# Altium project cirq_lcd.PrjPcb
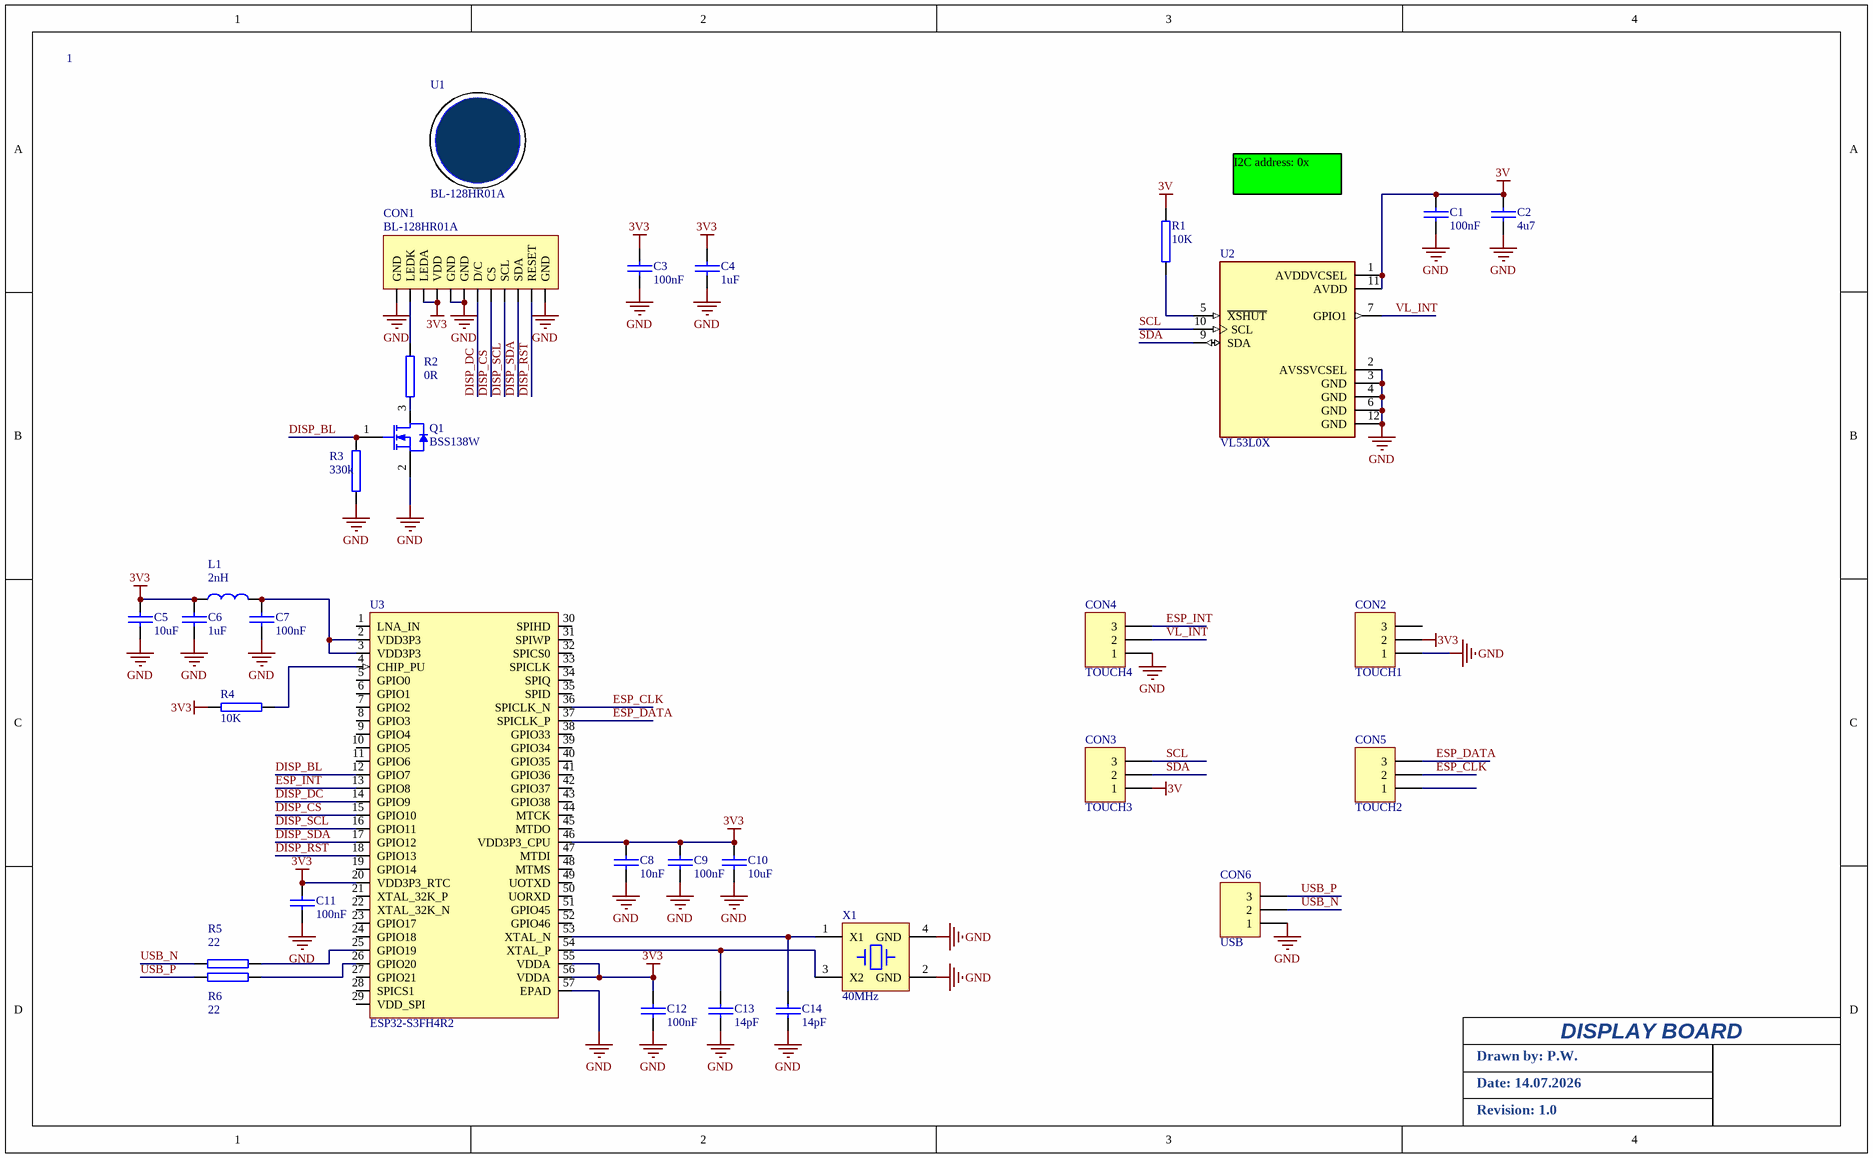
[diagram p0: cirq_lcd.SchDoc]
1 sheet, 33 parts. Net scope: global (net labels, ports and power ports of the same name join across sheets).
Board file: cirq_lcd.PcbDoc

## Sheet cirq_lcd.SchDoc
size 350 x 215 mm

### Parts
1  (no value)  [NEWLOGO2]
C1  100nF  [C0603L]
C2  4u7  [C0603L]
C3  100nF  [C0603L]
C4  1uF  [C0603L]
C5  10uF  [C0603L]
C6  1uF  [C0603L]
C7  100nF  [C0603L]
C8  10nF  [C0603L]
C9  100nF  [C0603L]
C10  10uF  [C0603L]
C11  100nF  [C0603L]
C12  100nF  [C0603L]
C13  14pF  [C0603L]
C14  14pF  [C0603L]
CON1  BL-128HR01A  [ROUND_TFT_1_28_C]
CON2  TOUCH1  [HDR1X3_2mm]
CON3  TOUCH3  [HDR1X3_2mm]
CON4  TOUCH4  [HDR1X3_2mm]
CON5  TOUCH2  [HDR1X3_2mm]
CON6  USB  [HDR1X3_1mm27]
L1  2nH  [L0603]
Q1  BSS138W  [SOT-323]
R1  10K  [1608[0603]]
R2  0R  [1608[0603]]
R3  330k  [1608[0603]]
R4  10K  [1608[0603]]
R5  22  [1608[0603]]
R6  22  [1608[0603]]
U1  BL-128HR01A  [ROUND_TFT_1_28_S]
U2  VL53L0X  [SENSOR_VL53L0X]
U3  ESP32-S3FH4R2  [QFN56_ESP32_7X7_EXP]
X1  40MHz  [X3x2]

### Nets
3V: C1.1 C2.1 CON3.1 R1.2 U2.1(AVDDVCSEL) U2.11(AVDD)
3V3: C3.1 C4.1 C5.1 C6.1 C8.1 C9.1 C10.1 C11.1 C12.1 CON1.3(LEDA) CON1.4(VDD) CON2.2 L1.1 R4.2 U3.20(VDD3P3_RTC) U3.46(VDD3P3_CPU) U3.55(VDDA) U3.56(VDDA)
GND: C1.2 C2.2 C3.2 C4.2 C5.2 C6.2 C7.2 C8.2 C9.2 C10.2 C11.2 C12.2 C13.2 C14.1 CON1.1(GND) CON1.5(GND) CON1.6(GND) CON1.12(GND) CON2.1 CON4.1 CON6.1 Q1.2(S) R3.1 U2.2(AVSSVCSEL) U2.3(GND) U2.4(GND) U2.6(GND) U2.12(GND) U3.57(EPAD) X1.2(GND) X1.4(GND)
DISP_BL: Q1.1(G) R3.2 U3.12(GPIO7)
DISP_CS: CON1.8(CS) U3.15(GPIO10)
DISP_DC: CON1.7(D/C) U3.14(GPIO9)
DISP_RST: CON1.11(RESET) U3.18(GPIO13)
DISP_SCL: CON1.9(SCL) U3.16(GPIO11)
DISP_SDA: CON1.10(SDA) U3.17(GPIO12)
ESP_CLK: CON5.2 U3.36(SPICLK_N)
ESP_DATA: CON5.3 U3.37(SPICLK_P)
ESP_INT: CON4.3 U3.13(GPIO8)
SCL: CON3.3 U2.10(SCL)
SDA: CON3.2 U2.9(SDA)
USB_N: CON6.2 R5.1
USB_P: CON6.3 R6.1
VL_INT: CON4.2 U2.7(GPIO1)
NetC7_1: C7.1 L1.2 U3.2(VDD3P3) U3.3(VDD3P3)
NetC13_1: C13.1 U3.54(XTAL_P) X1.3(X2)
NetC14_2: C14.2 U3.53(XTAL_N) X1.1(X1)
NetCON1_2: CON1.2(LEDK) R2.2
NetQ1_3: Q1.3(D) R2.1
NetR1_1: R1.1 U2.5(~{XSHUT})
NetR4_1: R4.1 U3.4(CHIP_PU)
NetR5_2: R5.2 U3.25(GPIO19)
NetR6_2: R6.2 U3.26(GPIO20)

Not connected (* = marked no-connect by the designer): CON2 3; CON5 1; U3 1(LNA_IN) 5(GPIO0) 6(GPIO1) 7(GPIO2) 8(GPIO3) 9(GPIO4) 10(GPIO5) 11(GPIO6) 19(GPIO14) 21(XTAL_32K_P) 22(XTAL_32K_N) 23(GPIO17) 24(GPIO18) 27(GPIO21) 28(SPICS1) 29(VDD_SPI) 30(SPIHD) 31(SPIWP) 32(SPICS0) 33(SPICLK) 34(SPIQ) 35(SPID) 38(GPIO33) 39(GPIO34) 40(GPIO35) 41(GPIO36) 42(GPIO37) 43(GPIO38) 44(MTCK) 45(MTDO) 47(MTDI) 48(MTMS) 49(UOTXD) 50(UORXD) 51(GPIO45) 52(GPIO46)

### Notes on the sheet
- I2C address: 0x
- DISPLAY BOARD
- Drawn by: P.W.
- Date: 14.07.2026
- Revision: 1.0

### Library data of the parts
1 = LOGO
C1-C14 = CAP: Capacitor
CON1 = ROUND_1_28_TFT_C: 1.28 COLOR TFT 240X240 CONNECTOR
CON2-CON6 = Header 3: Header, 3-Pin; LatestRevisionDate: 17-Jul-2002; LatestRevisionNote: Re-released for DXP Platform.; Publisher: Altium Limited
L1 = INDUCTOR
Q1 = BSS138W: N-MOSFET; Manufacturer 1: -; Manufacturer 1 PartNo: -; Supplier 1: -; Supplier 1 PartNo: -
R1-R6 = RES
U1 = ROUND_1_28_TFT_S: 1.28 COLOR TFT 240X240 SCREEN
U2 = VL53L0X: VL53L0X - Light, 3D Time-of-Flight _ToF_ Sensor Evaluation Board; MF: STMicroelectronics; MP: VL53L0X; Package: None; Price: None; Availability: Unavailable; SnapEDA_Link: https://www.snapeda.com/parts/VL53L0X/STMicroelectronics/view-part/473967/?ref=snap; Value: *
U3 = ESP32-S3: Bluetooth, WiFi 802.11b/g/n, Bluetooth v5.0 Transceiver Module 2.4GHz PCB Trace Surface Mount; Manufacturer: Espressif Systems; Manufacturer Part Number: ESP32-S3; ComponentLink1Description: Datasheet; ComponentLink1URL: https://www.espressif.com/sites/default/files/documentation/esp32-s3_datasheet_en.pdf
X1 = CRYSTAL3: TX3